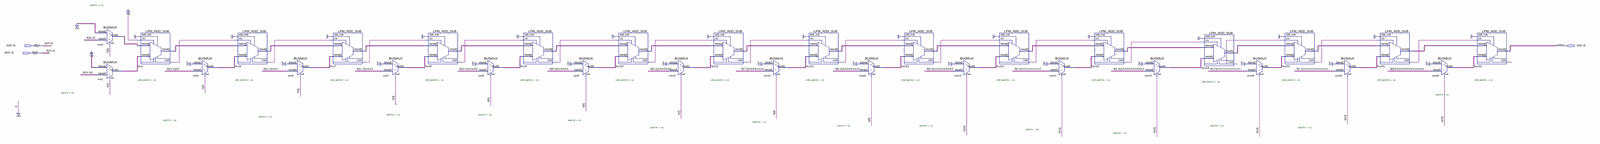
[diagram p0: schematic sheet, whole]
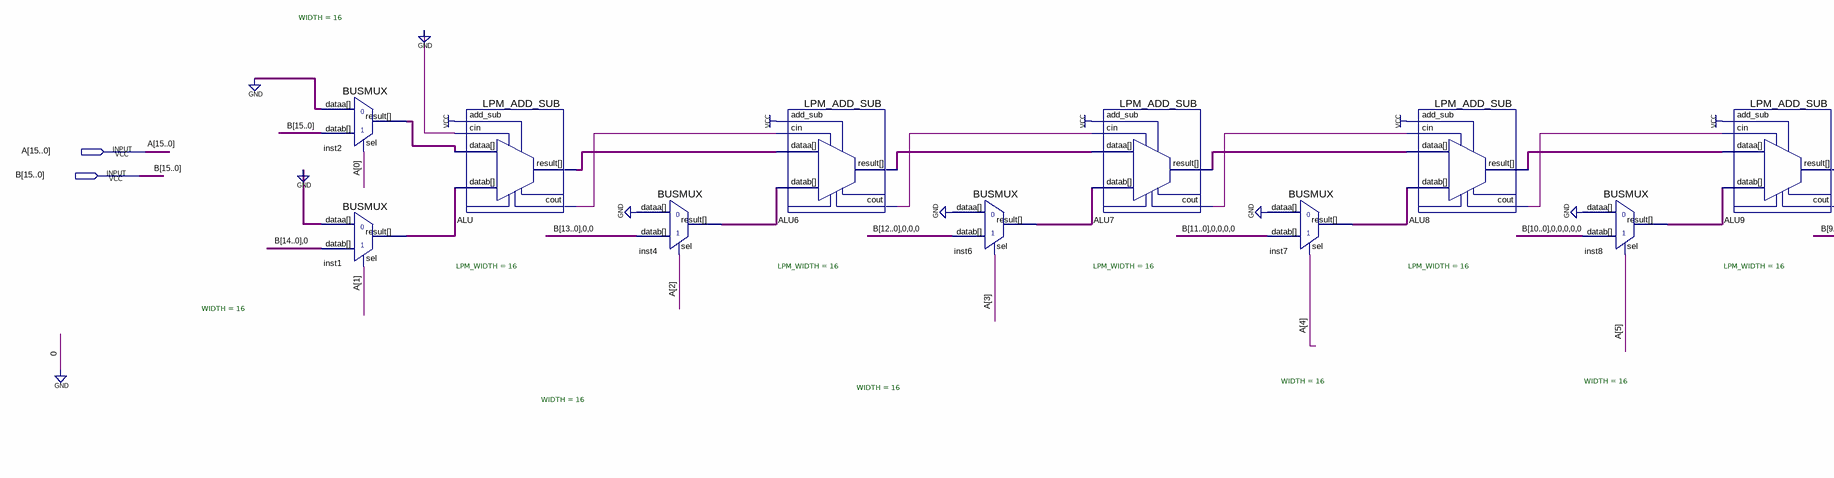
[diagram p1: schematic sheet, left part]
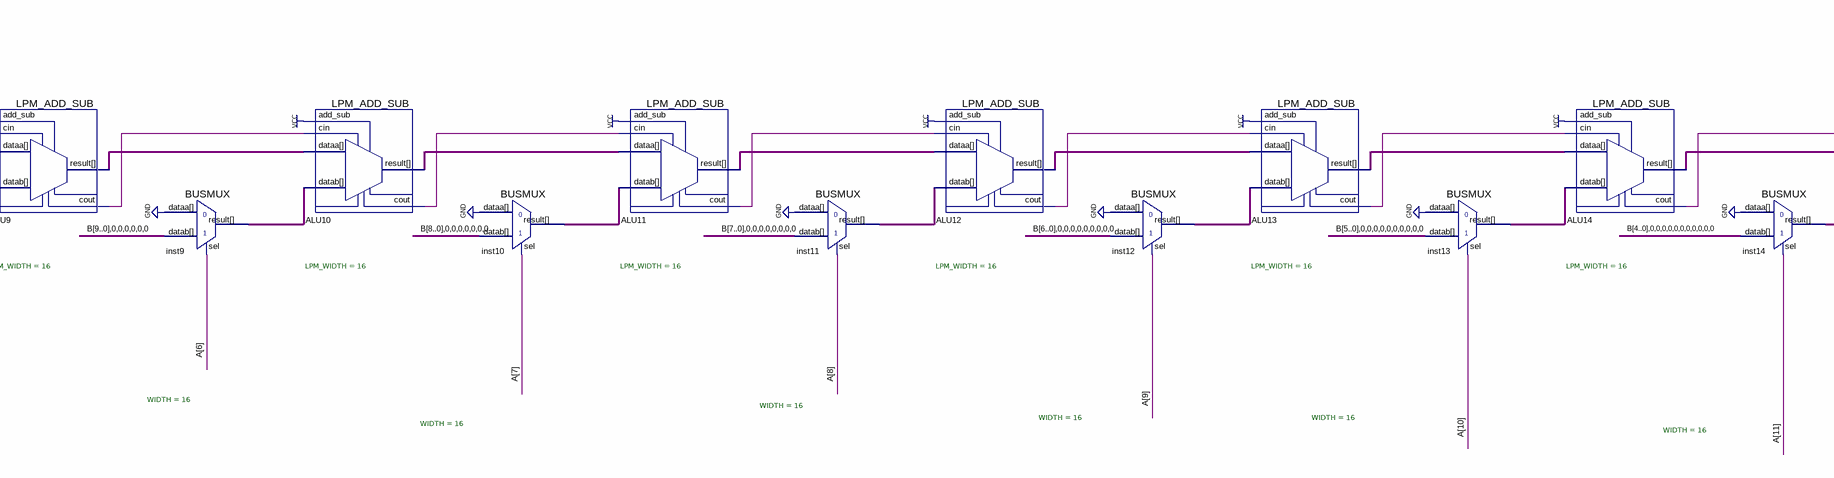
[diagram p2: schematic sheet, centre part]
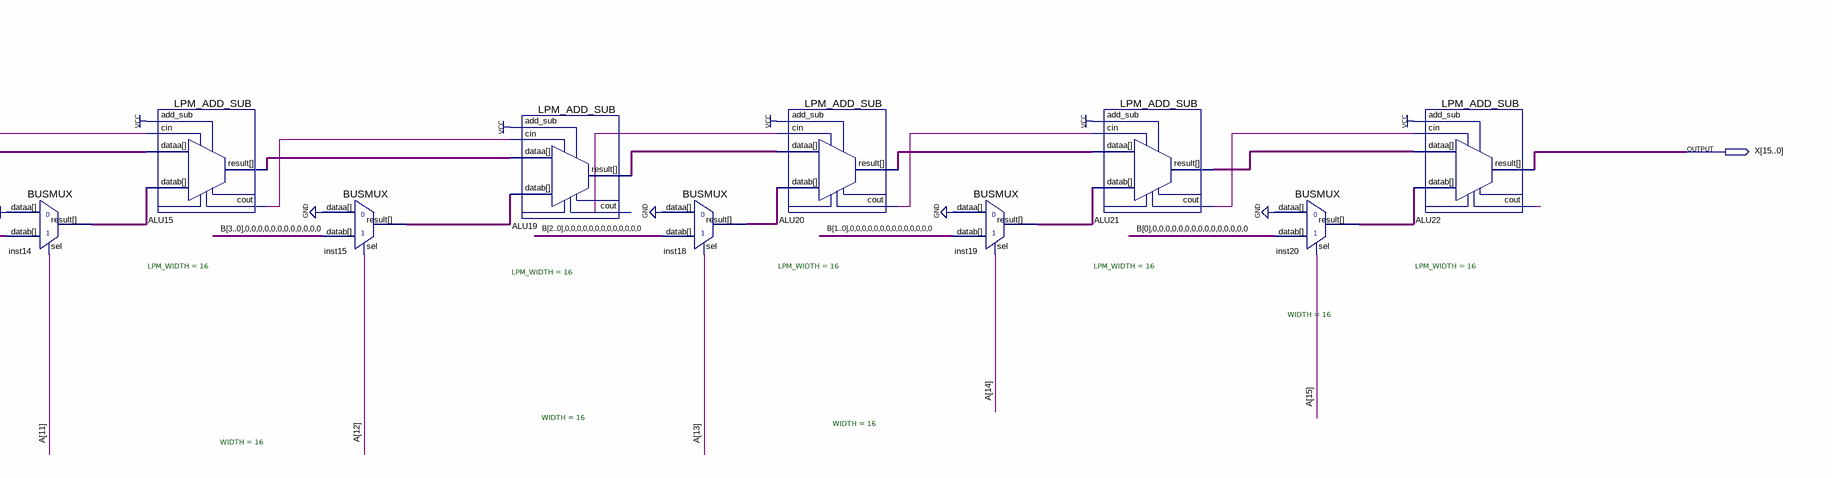
[diagram p3: schematic sheet, right part]
// Quartus schematic MULTIPLY.bdf as structural Verilog: 31 symbols, 3 pins
module MULTIPLY (
  input  [15:0] A,
  input  [15:0] B,
  output [15:0] X
);

  wire ALU6_cout, ALU7_cout, ALU8_cout, ALU9_cout, ALU10_cout, ALU11_cout, ALU12_cout, ALU13_cout,
       ALU14_cout, ALU15_cout, ALU19_cout, ALU20_cout, ALU21_cout, ALU22_cout, ALU_cout;
  wire [15:0] ALU6_result, ALU7_result, ALU8_result, ALU9_result, ALU10_result, ALU11_result, ALU12_result,
       ALU13_result, ALU14_result, ALU15_result, ALU19_result, ALU20_result, ALU21_result, ALU_result,
       inst1_result, inst2_result, inst4_result, inst6_result, inst7_result, inst8_result, inst9_result,
       inst10_result, inst11_result, inst12_result, inst13_result, inst14_result, inst15_result,
       inst18_result, inst19_result, inst20_result;

  BUSMUX #(.WIDTH(16)) inst2 (.datab(B), .sel(A[0]), .dataa({16{1'b0}}), .result(inst2_result));
  BUSMUX #(.WIDTH(16)) inst1 (.datab({B[14:0], 1'b0}), .sel(A[1]), .dataa({16{1'b0}}), .result(inst1_result));
  LPM_ADD_SUB #(.LPM_WIDTH(16)) ALU (
    .add_sub(1'b1), .cin(1'b0), .dataa(inst2_result), .datab(inst1_result), .cout(ALU_cout),
    .result(ALU_result));
  BUSMUX #(.WIDTH(16)) inst4 (.datab({B[13:0], 2'b00}), .sel(A[2]), .dataa({16{1'b0}}), .result(inst4_result));
  LPM_ADD_SUB #(.LPM_WIDTH(16)) ALU6 (
    .add_sub(1'b1), .cin(ALU_cout), .dataa(ALU_result), .datab(inst4_result), .cout(ALU6_cout),
    .result(ALU6_result));
  BUSMUX #(.WIDTH(16)) inst6 (.datab({B[12:0], 3'b000}), .sel(A[3]), .dataa({16{1'b0}}), .result(inst6_result));
  LPM_ADD_SUB #(.LPM_WIDTH(16)) ALU7 (
    .add_sub(1'b1), .cin(ALU6_cout), .dataa(ALU6_result), .datab(inst6_result), .cout(ALU7_cout),
    .result(ALU7_result));
  BUSMUX #(.WIDTH(16)) inst7 (.datab({B[11:0], 4'b0000}), .sel(A[4]), .dataa({16{1'b0}}), .result(inst7_result));
  LPM_ADD_SUB #(.LPM_WIDTH(16)) ALU8 (
    .add_sub(1'b1), .cin(ALU7_cout), .dataa(ALU7_result), .datab(inst7_result), .cout(ALU8_cout),
    .result(ALU8_result));
  BUSMUX #(.WIDTH(16)) inst8 (.datab({B[10:0], {5{1'b0}}}), .sel(A[5]), .dataa({16{1'b0}}), .result(inst8_result));
  LPM_ADD_SUB #(.LPM_WIDTH(16)) ALU9 (
    .add_sub(1'b1), .cin(ALU8_cout), .dataa(ALU8_result), .datab(inst8_result), .cout(ALU9_cout),
    .result(ALU9_result));
  BUSMUX #(.WIDTH(16)) inst9 (.datab({B[9:0], {6{1'b0}}}), .sel(A[6]), .dataa({16{1'b0}}), .result(inst9_result));
  LPM_ADD_SUB #(.LPM_WIDTH(16)) ALU10 (
    .add_sub(1'b1), .cin(ALU9_cout), .dataa(ALU9_result), .datab(inst9_result), .cout(ALU10_cout),
    .result(ALU10_result));
  BUSMUX #(.WIDTH(16)) inst10 (.datab({B[8:0], {7{1'b0}}}), .sel(A[7]), .dataa({16{1'b0}}), .result(inst10_result));
  LPM_ADD_SUB #(.LPM_WIDTH(16)) ALU11 (
    .add_sub(1'b1), .cin(ALU10_cout), .dataa(ALU10_result), .datab(inst10_result), .cout(ALU11_cout),
    .result(ALU11_result));
  BUSMUX #(.WIDTH(16)) inst11 (.datab({B[7:0], {8{1'b0}}}), .sel(A[8]), .dataa({16{1'b0}}), .result(inst11_result));
  LPM_ADD_SUB #(.LPM_WIDTH(16)) ALU12 (
    .add_sub(1'b1), .cin(ALU11_cout), .dataa(ALU11_result), .datab(inst11_result), .cout(ALU12_cout),
    .result(ALU12_result));
  BUSMUX #(.WIDTH(16)) inst12 (.datab({B[6:0], {9{1'b0}}}), .sel(A[9]), .dataa({16{1'b0}}), .result(inst12_result));
  LPM_ADD_SUB #(.LPM_WIDTH(16)) ALU13 (
    .add_sub(1'b1), .cin(ALU12_cout), .dataa(ALU12_result), .datab(inst12_result), .cout(ALU13_cout),
    .result(ALU13_result));
  BUSMUX #(.WIDTH(16)) inst13 (.datab({B[5:0], {10{1'b0}}}), .sel(A[10]), .dataa({16{1'b0}}), .result(inst13_result));
  LPM_ADD_SUB #(.LPM_WIDTH(16)) ALU14 (
    .add_sub(1'b1), .cin(ALU13_cout), .dataa(ALU13_result), .datab(inst13_result), .cout(ALU14_cout),
    .result(ALU14_result));
  BUSMUX #(.WIDTH(16)) inst14 (.datab({B[4:0], {11{1'b0}}}), .sel(A[11]), .dataa({16{1'b0}}), .result(inst14_result));
  LPM_ADD_SUB #(.LPM_WIDTH(16)) ALU15 (
    .add_sub(1'b1), .cin(ALU14_cout), .dataa(ALU14_result), .datab(inst14_result), .cout(ALU15_cout),
    .result(ALU15_result));
  BUSMUX #(.WIDTH(16)) inst15 (.datab({B[3:0], {12{1'b0}}}), .sel(A[12]), .dataa({16{1'b0}}), .result(inst15_result));
  LPM_ADD_SUB #(.LPM_WIDTH(16)) ALU19 (
    .add_sub(1'b1), .cin(ALU15_cout), .dataa(ALU15_result), .datab(inst15_result), .cout(ALU19_cout),
    .result(ALU19_result));
  BUSMUX #(.WIDTH(16)) inst18 (.datab({B[2:0], {13{1'b0}}}), .sel(A[13]), .dataa({16{1'b0}}), .result(inst18_result));
  LPM_ADD_SUB #(.LPM_WIDTH(16)) ALU20 (
    .add_sub(1'b1), .cin(ALU19_cout), .dataa(ALU19_result), .datab(inst18_result), .cout(ALU20_cout),
    .result(ALU20_result));
  BUSMUX #(.WIDTH(16)) inst19 (.datab({B[1:0], {14{1'b0}}}), .sel(A[14]), .dataa({16{1'b0}}), .result(inst19_result));
  LPM_ADD_SUB #(.LPM_WIDTH(16)) ALU21 (
    .add_sub(1'b1), .cin(ALU20_cout), .dataa(ALU20_result), .datab(inst19_result), .cout(ALU21_cout),
    .result(ALU21_result));
  BUSMUX #(.WIDTH(16)) inst20 (.datab({B[0], {15{1'b0}}}), .sel(A[15]), .dataa({16{1'b0}}), .result(inst20_result));
  LPM_ADD_SUB #(.LPM_WIDTH(16)) ALU22 (
    .add_sub(1'b1), .cin(ALU21_cout), .dataa(ALU21_result), .datab(inst20_result), .cout(ALU22_cout),
    .result(X));
endmodule
